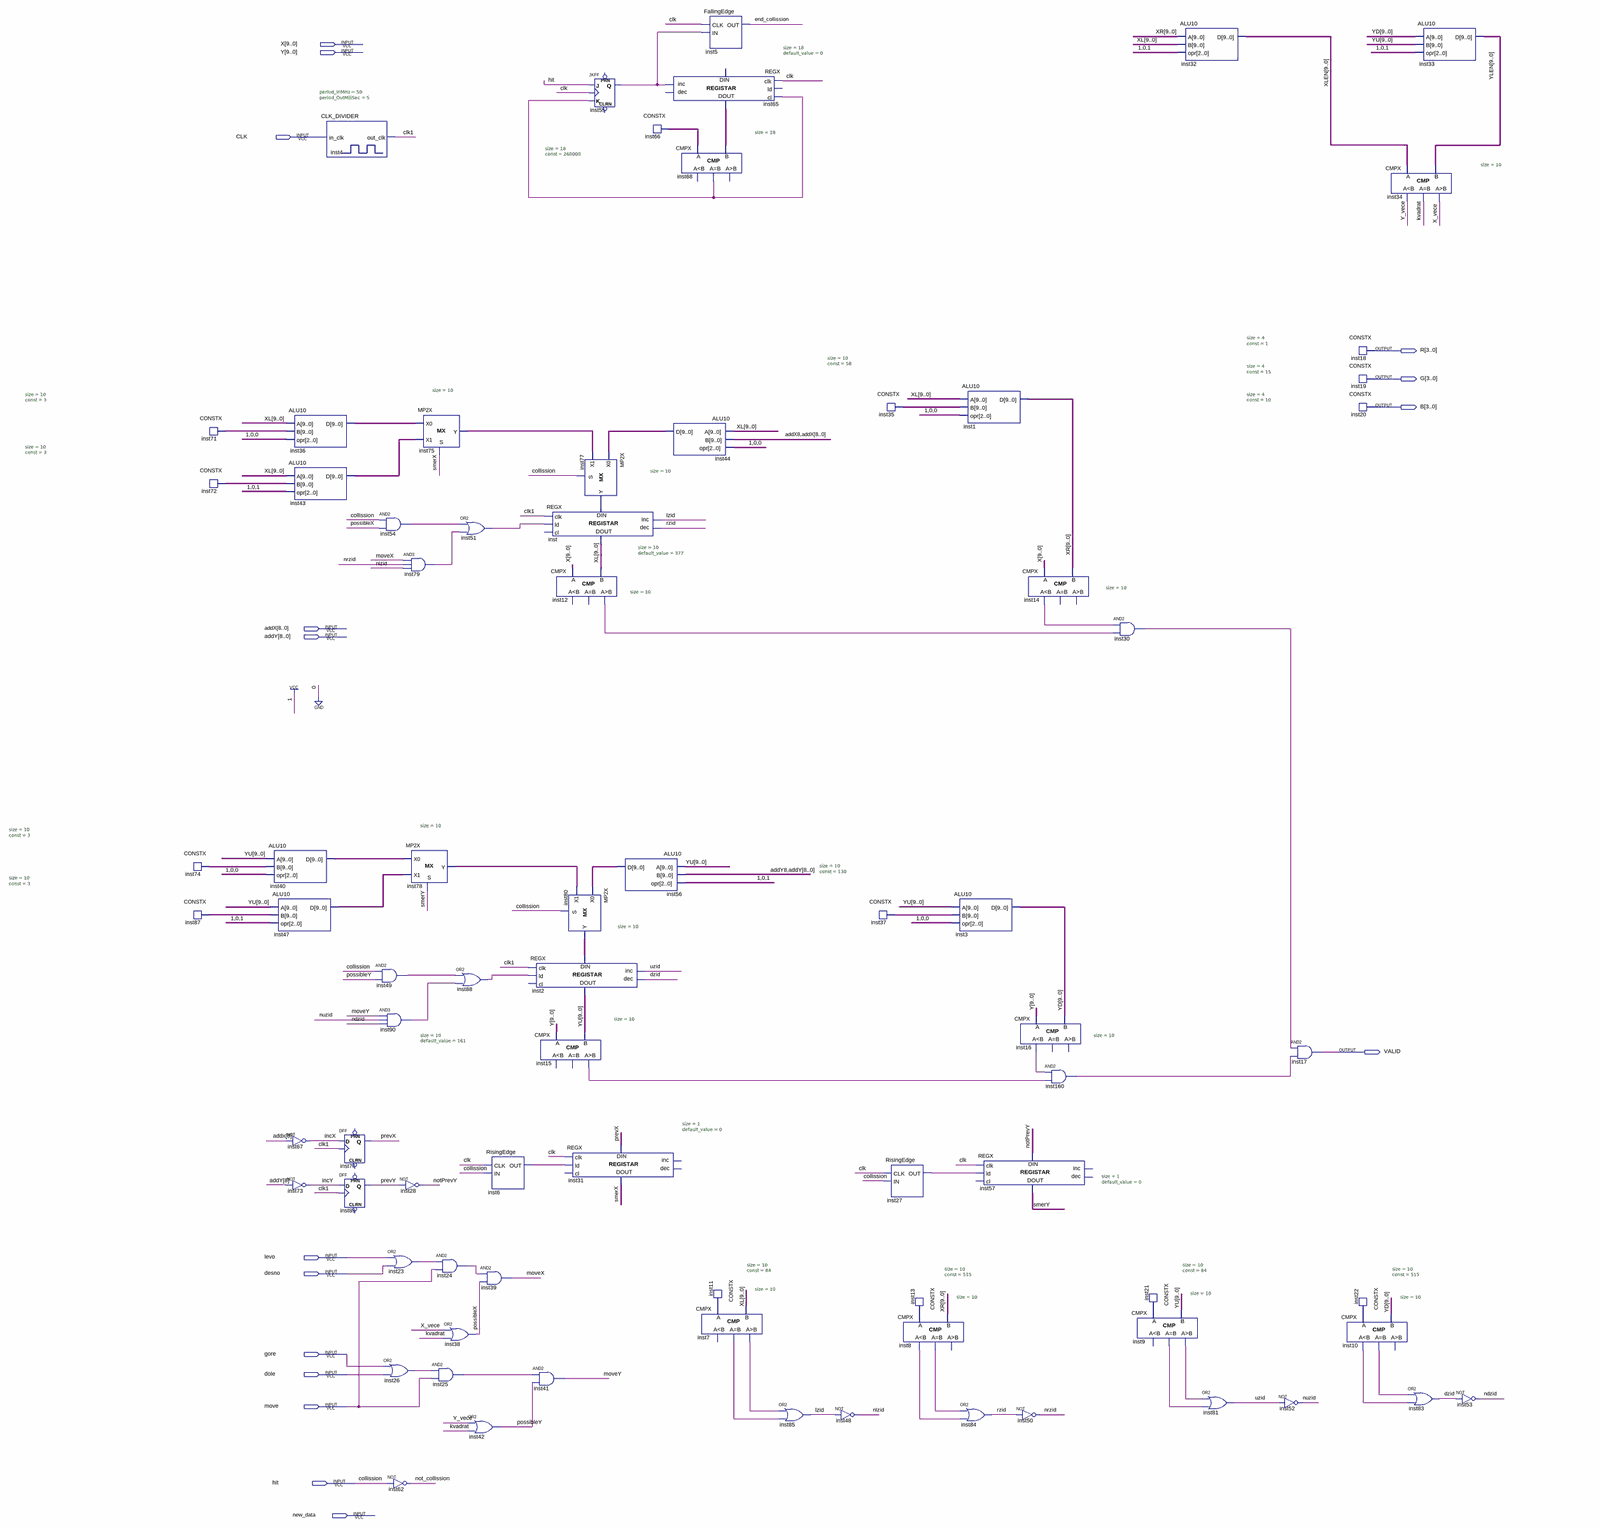
[diagram p0: schematic sheet, whole]
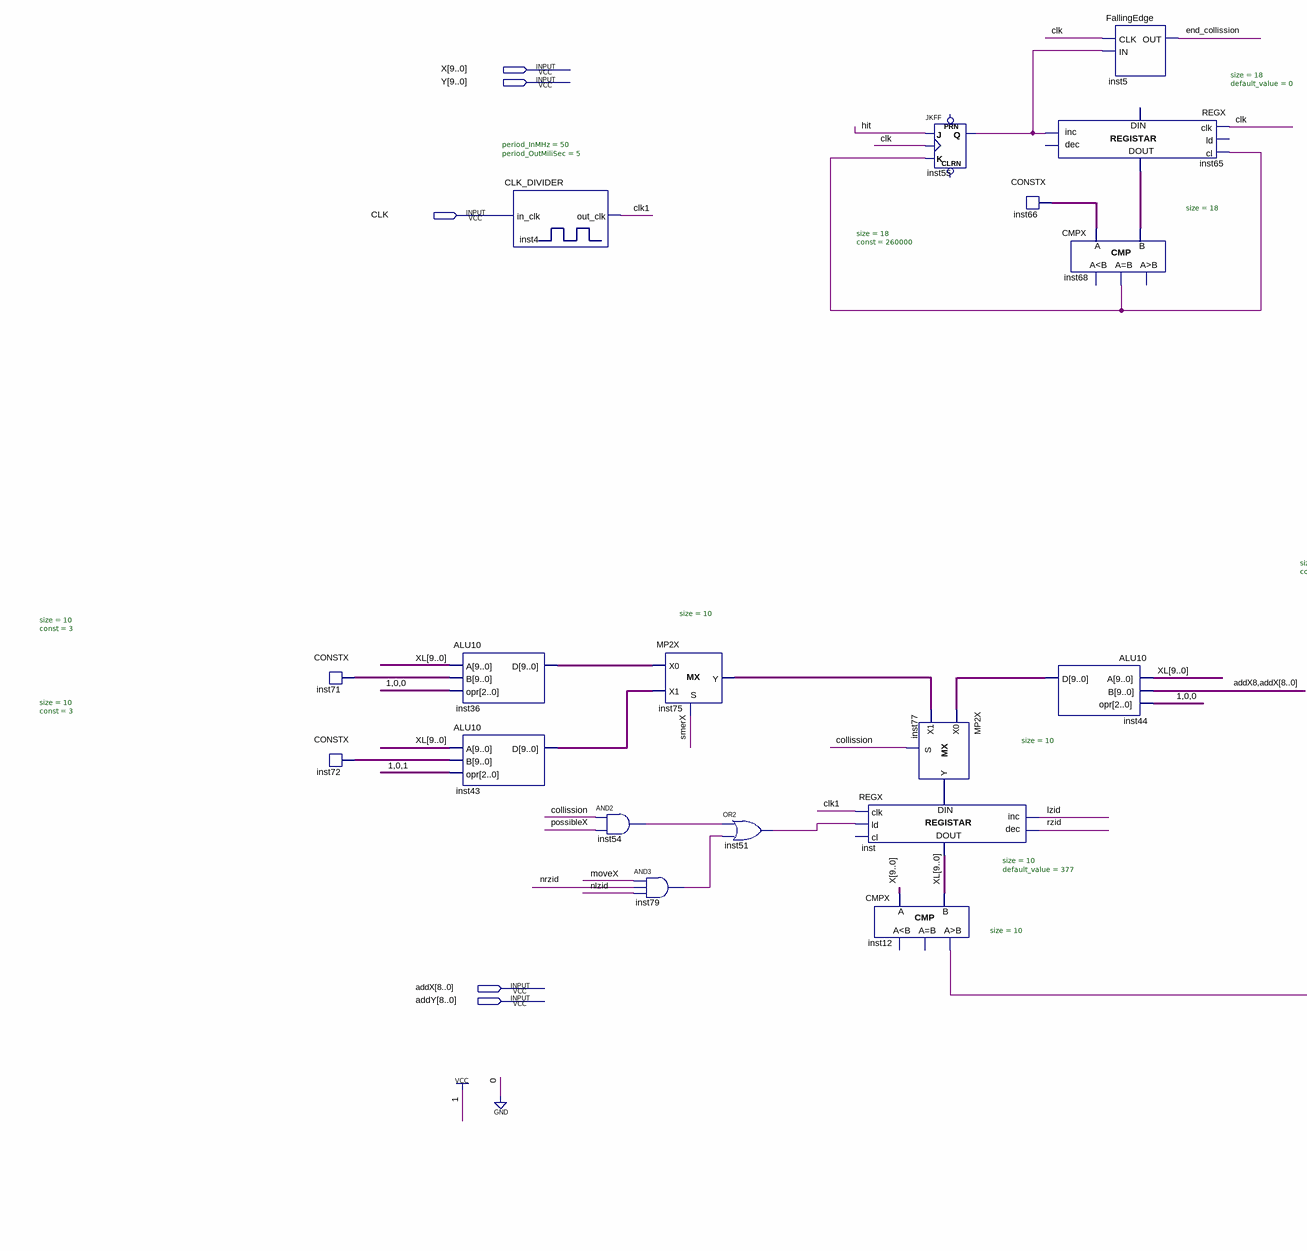
[diagram p1: schematic sheet, upper left part]
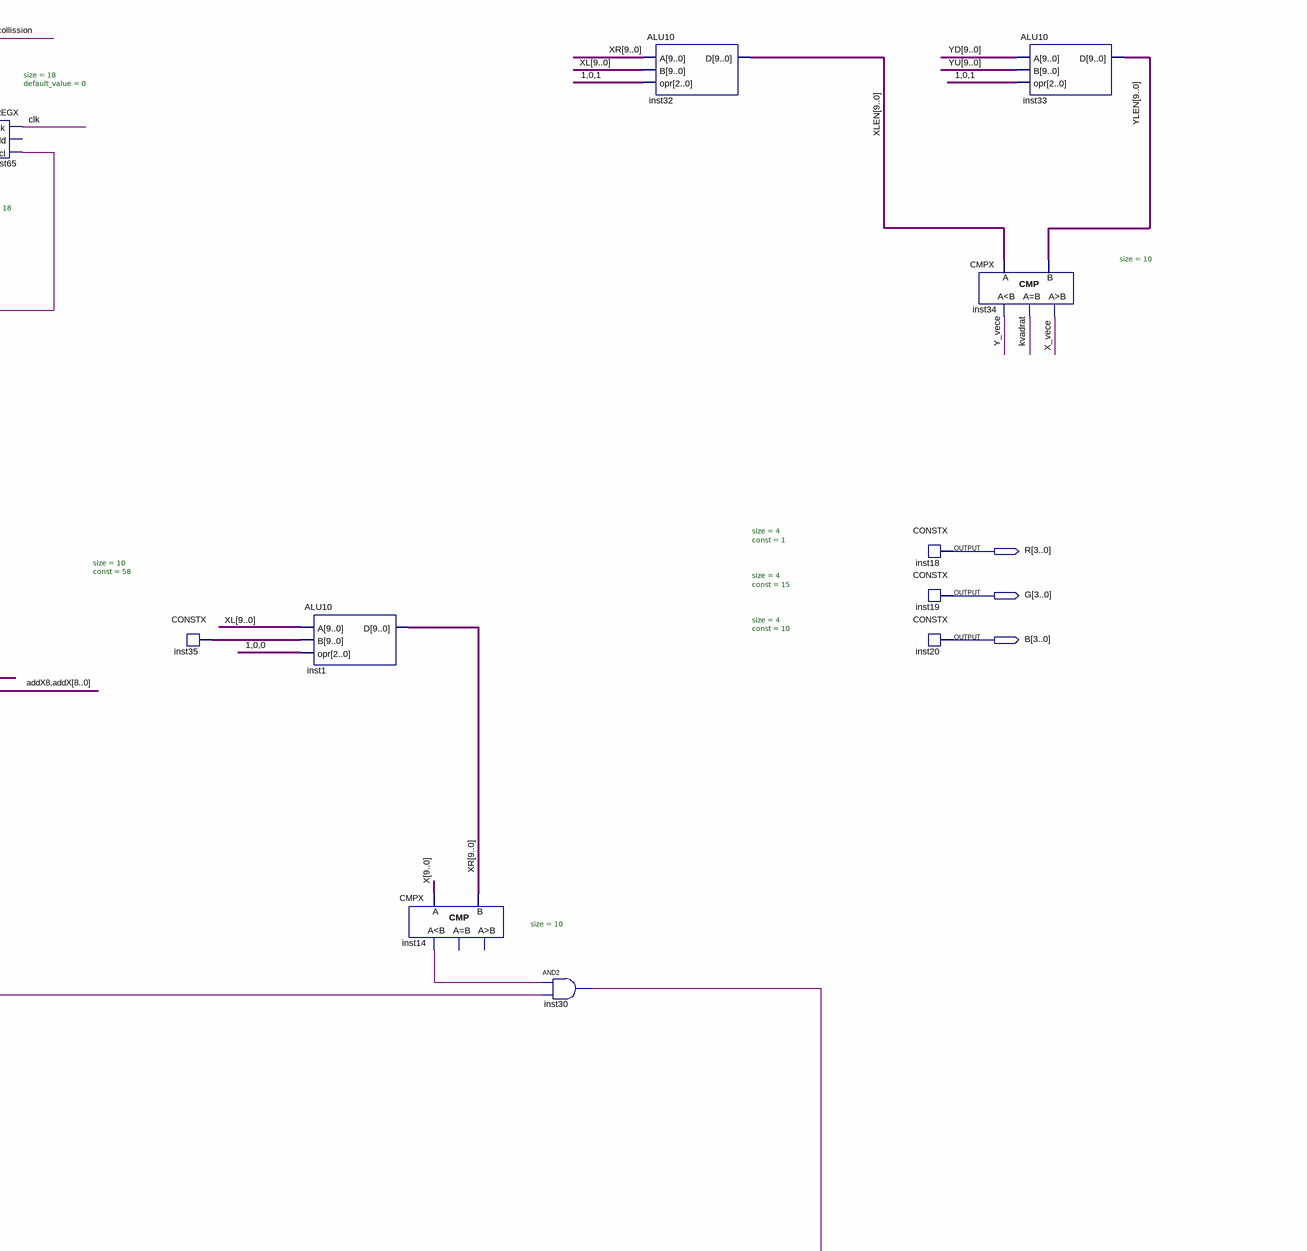
[diagram p2: schematic sheet, upper right part]
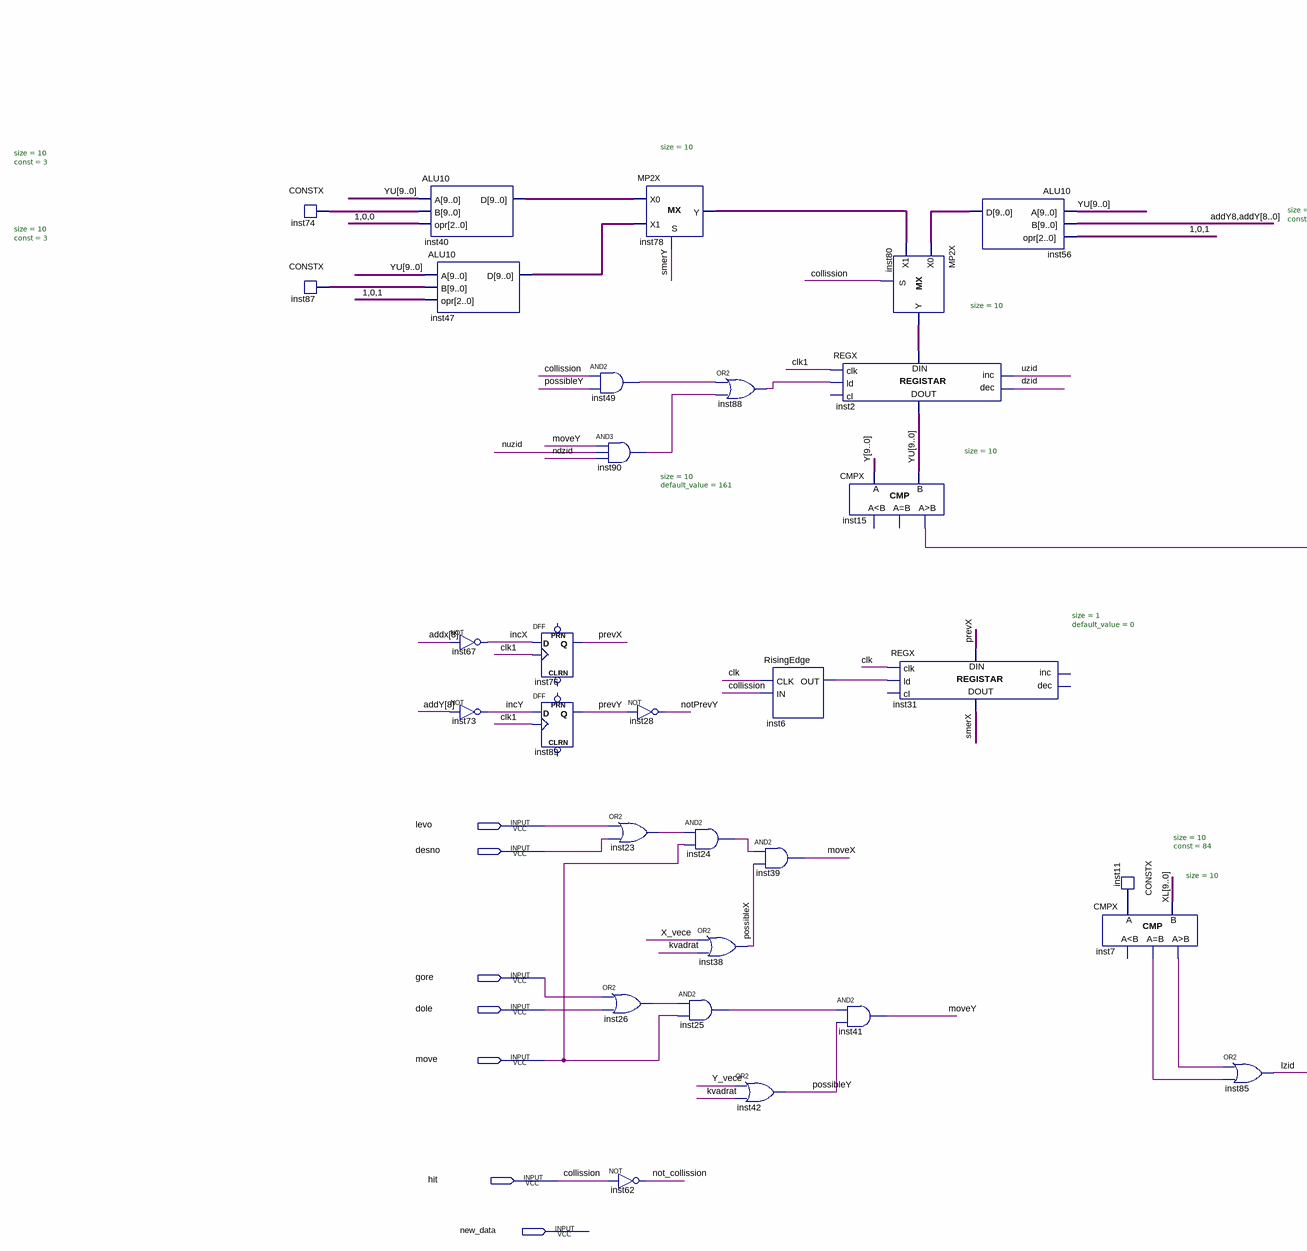
[diagram p3: schematic sheet, lower left part]
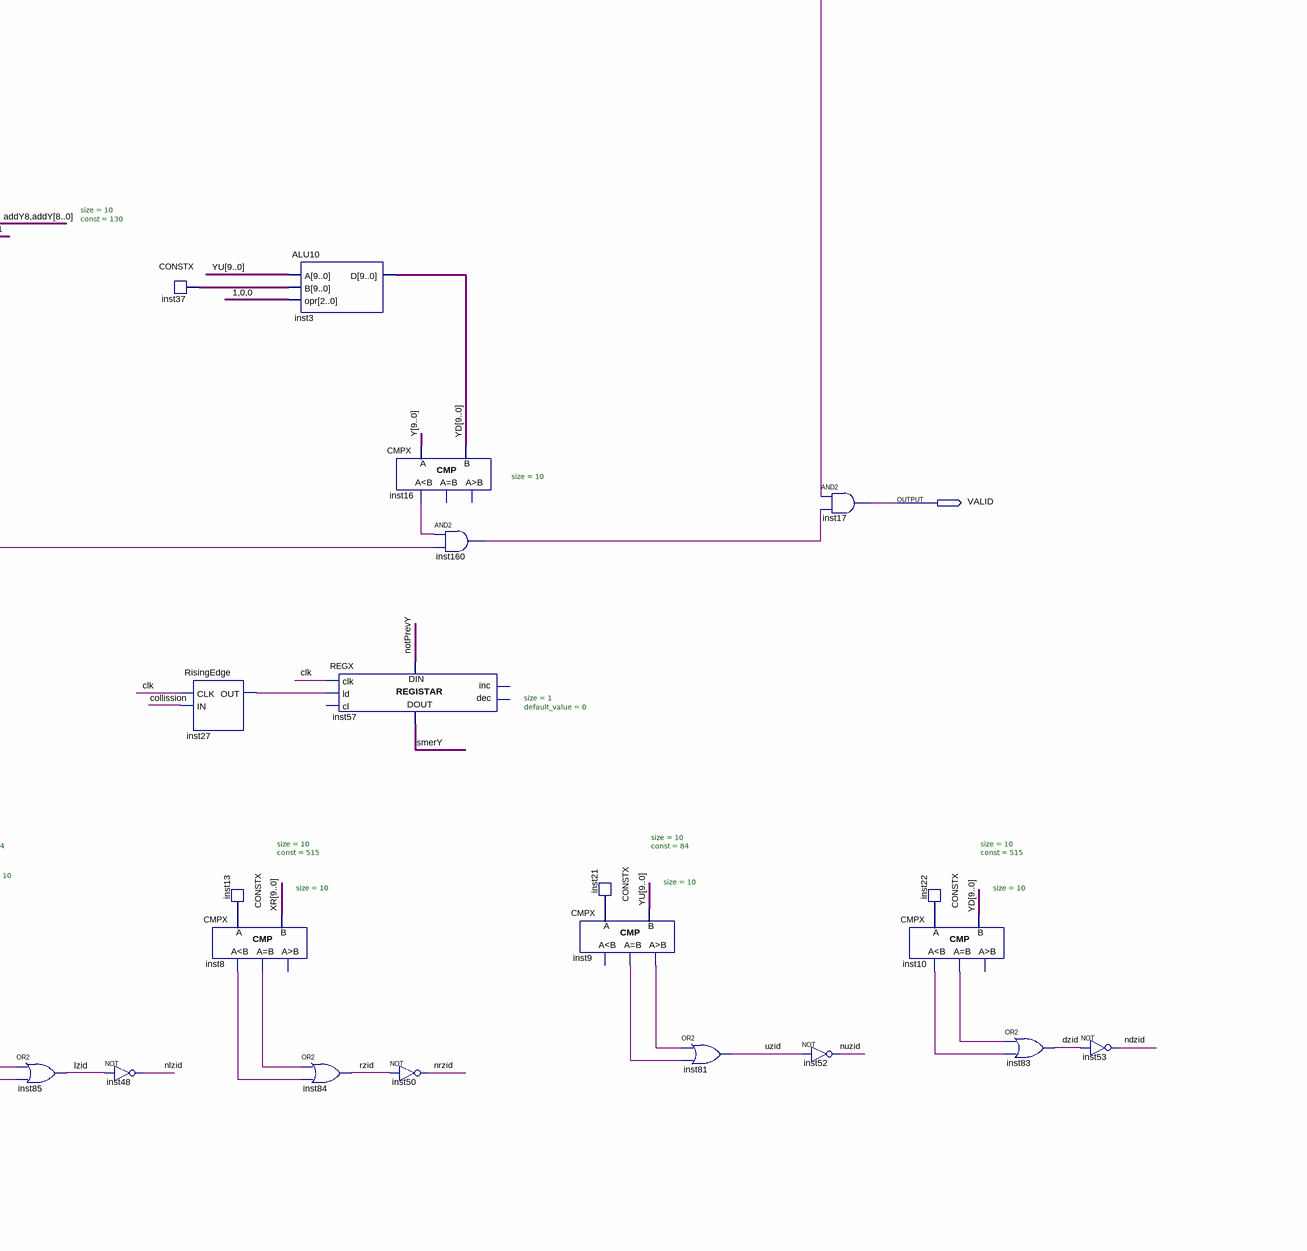
[diagram p4: schematic sheet, lower right part]
// Quartus schematic Block55.bdf as structural Verilog: 79 symbols, 16 pins
module Block55 (
  input  [9:0] X,
  input  [9:0] Y,
  input  CLK,
  input  [8:0] addX,
  input  [8:0] addY,
  input  levo,
  input  desno,
  input  gore,
  input  dole,
  input  move,
  input  hit,
  input  new_data,
  output [3:0] R,
  output [3:0] G,
  output [3:0] B,
  output VALID
);

  wire clk1, dzid, end_collission, incX, incY, inst6_out, inst7_eq, inst7_gr, inst8_eq, inst8_ls, inst9_eq,
       inst9_gr, inst10_eq, inst10_ls, inst12_gr, inst14_ls, inst15_gr, inst16_ls, inst23_out, inst24_out,
       inst25_out, inst26_out, inst27_out, inst30_out, inst49_out, inst51_out, inst54_out, inst55_q,
       inst68_eq, inst79_out, inst88_out, inst90_out, inst160_out, kvadrat, lzid, moveX, moveY, ndzid, nlzid,
       not_collission, notPrevY, nrzid, nuzid, possibleX, possibleY, prevX, prevY, rzid, smerX, smerY, uzid,
       X_vece, Y_vece;
  wire [9:0] inst11_data, inst13_data, inst21_data, inst22_data, inst35_data, inst36_d, inst37_data,
       inst40_d, inst43_d, inst44_d, inst47_d, inst56_d, inst71_data, inst72_data, inst74_data, inst75_y,
       inst77_y, inst78_y, inst80_y, inst87_data, XL, XLEN, XR, YD, YLEN, YU;
  wire [17:0] inst65_data_out, inst66_data;

  CONSTX #(.size(10), .\const (3)) inst74 (.data(inst74_data));
  CONSTX #(.size(10), .\const (3)) inst87 (.data(inst87_data));
  CONSTX #(.size(10), .\const (3)) inst71 (.data(inst71_data));
  CONSTX #(.size(10), .\const (3)) inst72 (.data(inst72_data));
  ALU10 inst40 (.A(YU), .B(inst74_data), .opr(3'b100), .D(inst40_d));
  ALU10 inst47 (.A(YU), .B(inst87_data), .opr(3'b101), .D(inst47_d));
  ALU10 inst36 (.A(XL), .B(inst71_data), .opr(3'b100), .D(inst36_d));
  ALU10 inst43 (.A(XL), .B(inst72_data), .opr(3'b101), .D(inst43_d));
  not inst67 (incX, addX[8]);
  not inst73 (incY, addY[8]);
  CLK_DIVIDER #(.period_InMHz(50), .period_OutMiliSec(5)) inst4 (.in_clk(CLK), .out_clk(clk1));
  DFF inst76 (.CLK(clk1), .D(incX), .Q(prevX));  // open: CLRN, PRN
  DFF inst89 (.CLK(clk1), .D(incY), .Q(prevY));  // open: CLRN, PRN
  and inst54 (inst54_out, hit, possibleX);
  and inst49 (inst49_out, hit, possibleY);
  and inst90 (inst90_out, moveY, nuzid, ndzid);
  and inst79 (inst79_out, moveX, nrzid, nlzid);
  MP2X #(.size(10)) inst78 (.S(smerY), .X0(inst40_d), .X1(inst47_d), .Y(inst78_y));
  not inst28 (notPrevY, prevY);
  or inst23 (inst23_out, levo, desno);
  or inst26 (inst26_out, gore, dole);
  not inst62 (not_collission, hit);
  MP2X #(.size(10)) inst75 (.S(smerX), .X0(inst36_d), .X1(inst43_d), .Y(inst75_y));
  and inst24 (inst24_out, inst23_out, move);
  or inst38 (possibleX, X_vece, kvadrat);
  and inst25 (inst25_out, inst26_out, move);
  or inst51 (inst51_out, inst54_out, inst79_out);
  or inst88 (inst88_out, inst49_out, inst90_out);
  or inst42 (possibleY, Y_vece, kvadrat);
  RisingEdge inst6 (.CLK(CLK), .IN(hit), .OUT(inst6_out));
  and inst39 (moveX, inst24_out, possibleX);
  REGX #(.size(10), .default_value(161)) inst2 (
    .clk(clk1), .ld(inst88_out), .inc(uzid), .dec(dzid), .data_in(inst80_y), .data_out(YU));  // open: cl
  CMPX #(.size(10)) inst15 (.A(Y), .B(YU), .gr(inst15_gr));  // open: ls, eq
  and inst41 (moveY, inst25_out, possibleY);
  REGX #(.size(10), .default_value(377)) inst (
    .clk(clk1), .ld(inst51_out), .inc(lzid), .dec(rzid), .data_in(inst77_y), .data_out(XL));  // open: cl
  CMPX #(.size(10)) inst12 (.A(X), .B(XL), .gr(inst12_gr));  // open: ls, eq
  MP2X #(.size(10)) inst80 (.S(hit), .X0(inst56_d), .X1(inst78_y), .Y(inst80_y));
  REGX #(.size(1), .default_value(0)) inst31 (
    .clk(CLK), .ld(inst6_out), .data_in(prevX), .data_out(smerX));  // open: cl, inc, dec
  JKFF inst55 (.K(inst68_eq), .J(hit), .CLK(CLK), .Q(inst55_q));  // open: PRN, CLRN
  MP2X #(.size(10)) inst77 (.S(hit), .X0(inst44_d), .X1(inst75_y), .Y(inst77_y));
  ALU10 inst56 (.A(YU), .B({{2{addY[8]}}, addY[7:0]}), .opr(3'b101), .D(inst56_d));
  REGX #(.size(18), .default_value(0)) inst65 (
    .clk(CLK), .cl(inst68_eq), .inc(inst55_q), .data_out(inst65_data_out));  // open: ld, dec, data_in
  CONSTX #(.size(18), .\const (260000)) inst66 (.data(inst66_data));
  ALU10 inst44 (.A(XL), .B({{2{addX[8]}}, addX[7:0]}), .opr(3'b100), .D(inst44_d));
  FallingEdge inst5 (.CLK(CLK), .IN(inst55_q), .OUT(end_collission));
  CMPX #(.size(18)) inst68 (.A(inst66_data), .B(inst65_data_out), .eq(inst68_eq));  // open: ls, gr
  CMPX #(.size(10)) inst7 (.A(inst11_data), .B(XL), .eq(inst7_eq), .gr(inst7_gr));  // open: ls
  CONSTX #(.size(10), .\const (84)) inst11 (.data(inst11_data));
  or inst85 (lzid, inst7_gr, inst7_eq);
  not inst48 (nlzid, lzid);
  CONSTX #(.size(10), .\const (58)) inst35 (.data(inst35_data));
  CONSTX #(.size(10), .\const (130)) inst37 (.data(inst37_data));
  RisingEdge inst27 (.CLK(CLK), .IN(hit), .OUT(inst27_out));
  CMPX #(.size(10)) inst8 (.A(inst13_data), .B(XR), .ls(inst8_ls), .eq(inst8_eq));  // open: gr
  CONSTX #(.size(10), .\const (515)) inst13 (.data(inst13_data));
  ALU10 inst1 (.A(XL), .B(inst35_data), .opr(3'b100), .D(XR));
  ALU10 inst3 (.A(YU), .B(inst37_data), .opr(3'b100), .D(YD));
  or inst84 (rzid, inst8_eq, inst8_ls);
  REGX #(.size(1), .default_value(0)) inst57 (
    .clk(CLK), .ld(inst27_out), .data_in(notPrevY), .data_out(smerY));  // open: cl, inc, dec
  CMPX #(.size(10)) inst14 (.A(X), .B(XR), .ls(inst14_ls));  // open: eq, gr
  CMPX #(.size(10)) inst16 (.A(Y), .B(YD), .ls(inst16_ls));  // open: eq, gr
  not inst50 (nrzid, rzid);
  and inst160 (inst160_out, inst16_ls, inst15_gr);
  and inst30 (inst30_out, inst14_ls, inst12_gr);
  CONSTX #(.size(10), .\const (84)) inst21 (.data(inst21_data));
  CMPX #(.size(10)) inst9 (.A(inst21_data), .B(YU), .eq(inst9_eq), .gr(inst9_gr));  // open: ls
  ALU10 inst32 (.A(XR), .B(XL), .opr(3'b101), .D(XLEN));
  or inst81 (uzid, inst9_gr, inst9_eq);
  not inst52 (nuzid, uzid);
  and inst17 (VALID, inst30_out, inst160_out);
  CONSTX #(.size(4), .\const (1)) inst18 (.data(R));
  CONSTX #(.size(4), .\const (15)) inst19 (.data(G));
  CONSTX #(.size(4), .\const (10)) inst20 (.data(B));
  CMPX #(.size(10)) inst10 (.A(inst22_data), .B(YD), .ls(inst10_ls), .eq(inst10_eq));  // open: gr
  CONSTX #(.size(10), .\const (515)) inst22 (.data(inst22_data));
  CMPX #(.size(10)) inst34 (.A(XLEN), .B(YLEN), .ls(Y_vece), .eq(kvadrat), .gr(X_vece));
  or inst83 (dzid, inst10_eq, inst10_ls);
  ALU10 inst33 (.A(YD), .B(YU), .opr(3'b101), .D(YLEN));
  not inst53 (ndzid, dzid);

  // Other names for the same wires on the sheet: collission = hit
endmodule
